# Altium project Boost.PrjPcb
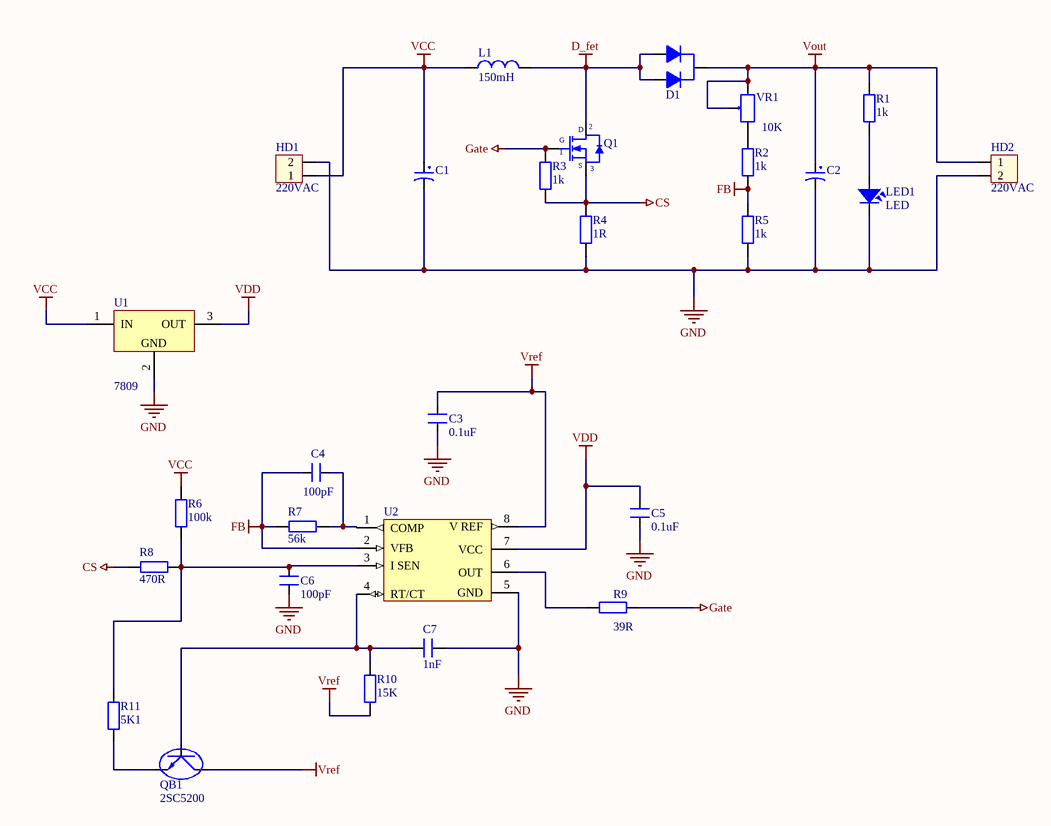
[diagram p0: BoostUC3843.SchDoc]
2 sheets, 28 parts. Net scope: global (net labels, ports and power ports of the same name join across sheets).
Board file: Boost.PcbDoc
Sheets:
  BoostUC3843.SchDoc
  ksjdklsdjsldj.SchDoc

## Sheet BoostUC3843.SchDoc
size A4; SheetNumber: 1; SheetTotal: 2

### Parts
C1  100uF/35V  [CP1.5/3.4]  (value not drawn)
C2  100uF/35V  [CA-ALU-10GR]  (value not drawn)
C3  0.1uF  [CN-SMD-0805]
C4  100pF  [CN-SMD-0805]
C5  0.1uF  [CN-SMD-0805]
C6  100pF  [CN-SMD-0805]
C7  1nF  [CN-SMD-0805]
D1  Diode  [TO-220]  (value not drawn)
HD1  220VAC  [HED2]
HD2  220VAC  [HED2]
L1  150mH  [0077930A7-core]
LED1  LED  [LED-3]
Q1  IRF840  [TO-220]  (value not drawn)
QB1  2SC5200  [SOT23]
R1  1k  [RES-SMD-0805]
R2  1k  [RES-SMD-0805]
R3  1k  [RES-SMD-0805]
R4  1R  [RES-SMD-2512]
R5  1k  [RES-SMD-0805]
R6  100k  [RES-SMD-0805]
R7  56k  [RES-SMD-0805]
R8  470R  [RES-SMD-0805]
R9  39R  [R1206]
R10  15K  [RES-SMD-0805]
R11  5K1  [RES-SMD-0805]
U1  7809  [TO-252]
U2  UC3843AN  [SO-8]  (value not drawn)
VR1  10K  [VR1]

### Nets
CS: Q1.3(S) R3.1 R4.2 R8.2
D_fet: D1.1(A) D1.3(A) L1.2 Q1.2(D)
FB: C4.2 R2.1 R5.2 R7.2 U2.2(VFB)
Gate: Q1.1(G) R3.2 R9.2
GND: C1.2 C2.2 C3.1 C5.1 C6.1 C7.1 HD1.2 HD2.2 LED1.2 R4.1 R5.1 U1.2(GND) U2.5(GND)
VCC: C1.1 HD1.1 L1.1 R6.1 U1.1(IN)
VDD: C5.2 U1.3(OUT) U2.7(VCC)
Vout: C2.1 D1.2(K) HD2.1 R1.2 VR1.2 VR1.3
Vref: C3.2 QB1.2(C) R10.1 U2.8(V_REF)
NetC4_1: C4.1 R7.1 U2.1(COMP)
NetC6_2: C6.2 R6.2 R8.1 R11.2 U2.3(I_SEN)
NetC7_2: C7.2 QB1.1(B) R10.2 U2.4(RT/CT)
NetLED1_1: LED1.1 R1.1
NetQB1_3: QB1.3(E) R11.1
NetR2_2: R2.2 VR1.1
NetR9_1: R9.1 U2.6(OUT)

### Library data of the parts
C1 C2 = CP3: Cap 100uF/35V - 470uF/16V; Value: 100uF/35V/50V; Description 1: 1000uF/6,3V - 470uF/16V - 330uF - 25V; Description 2: 220uF/35V - 100uF/50V - 63V - 4,7uF/200V; Description 3: 22uF => 33uF100V - 3,3uF => 4,7uF/250V; Description 4: 2,2uF =>3,3uF/350 - 2,2uF/400V - 1uF/450V
C3-C7 = CM: Cap SMD; Value: 103
HD1 HD2 = Hed2: Header 2 (Green); Value: Header 2
L1 = L1: Inductor; Value: 150 mH
LED1 = LED: LED Single colour Green and Red; Value: LED 3 ly Single Colour
Q1 = IRF840: MOSFET N - CHANNEL 500V - 0.75 - 8A - TO-220; Value: IRF840
QB1 = 2SC5200: Transistor Power Supply; Value: D718
R1-R11 = RES_SMD: Resistor 1/4W; Value: R1/4W - 1K
U1 = 7809: Positive Voltage Regulator; Note: Tab is connected to pin 3 (GND).; Published: 24-Aug-2001; LatestRevisionDate: 17-Jul-2002; LatestRevisionNote: Re-released for DXP Platform.; DatasheetVersion: Apr-1994; PackageReference: SOT82C; Publisher: Altium Limited; PackageDescription: SIP; 3 Leads; Body 10.9 x 7.6 x 2.6 mm (typ); Pitch 2.2 mm; ComponentLink1Description: Manufacturer Link; ComponentLink1URL: http://www.st.com/; ComponentLink2Description: Datasheet; ComponentLink2URL: http://www.st.com/stonline/products/literature/ds/2146/l78m05c.pdf
U2 = UC3843AN: High-Performance Current Mode PWM Controller; Published: 24-Aug-2001; LatestRevisionDate: 06-Jun-2005; LatestRevisionNote: Stylized 3D Model Added.; DatasheetVersion: Mar-1999; PackageReference: DIP8; Publisher: Altium Limited; PackageDescription: DIP; 8 Leads; Row Spacing 7.62 mm; Pitch 2.54 mm; Code_JEDEC: MO-001-AN; ComponentLink1Description: Manufacturer Link; ComponentLink1URL: http://www.st.com/; ComponentLink2Description: Datasheet; ComponentLink2URL: http://www.st.com/stonline/products/literature/ds/4298/uc3842a.pdf
VR1 = VR: Var Resistor; Value: VR 10K

## Sheet ksjdklsdjsldj.SchDoc
size A4; SheetNumber: 2; SheetTotal: 2